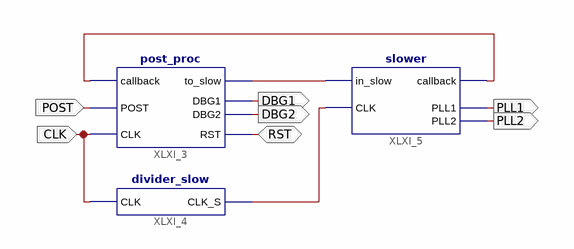
[diagram p0: schematic sheet 1]
// Xilinx ISE schematic overall.sch (xbr) as structural Verilog: 3 symbols, 7 ports
module overall (
  input  CLK,
  input  POST,
  inout  RST,
  output DBG1,
  output DBG2,
  output PLL1,
  output PLL2
);

  wire XLXN_6, XLXN_7, XLXN_11;

  post_proc XLXI_3 (.CLK(CLK), .to_slow(XLXN_6), .RST(RST), .POST(POST), .callback(XLXN_11), .DBG1(DBG1), .DBG2(DBG2));
  divider_slow XLXI_4 (.CLK(CLK), .CLK_S(XLXN_7));
  slower XLXI_5 (.CLK(XLXN_7), .in_slow(XLXN_6), .PLL1(PLL1), .callback(XLXN_11), .PLL2(PLL2));
endmodule
